# EasyEDA Pro project 正点原子转接.eprj

# Schematic Schematic1
Board Name: Board1; Create Date: 2025-07-12
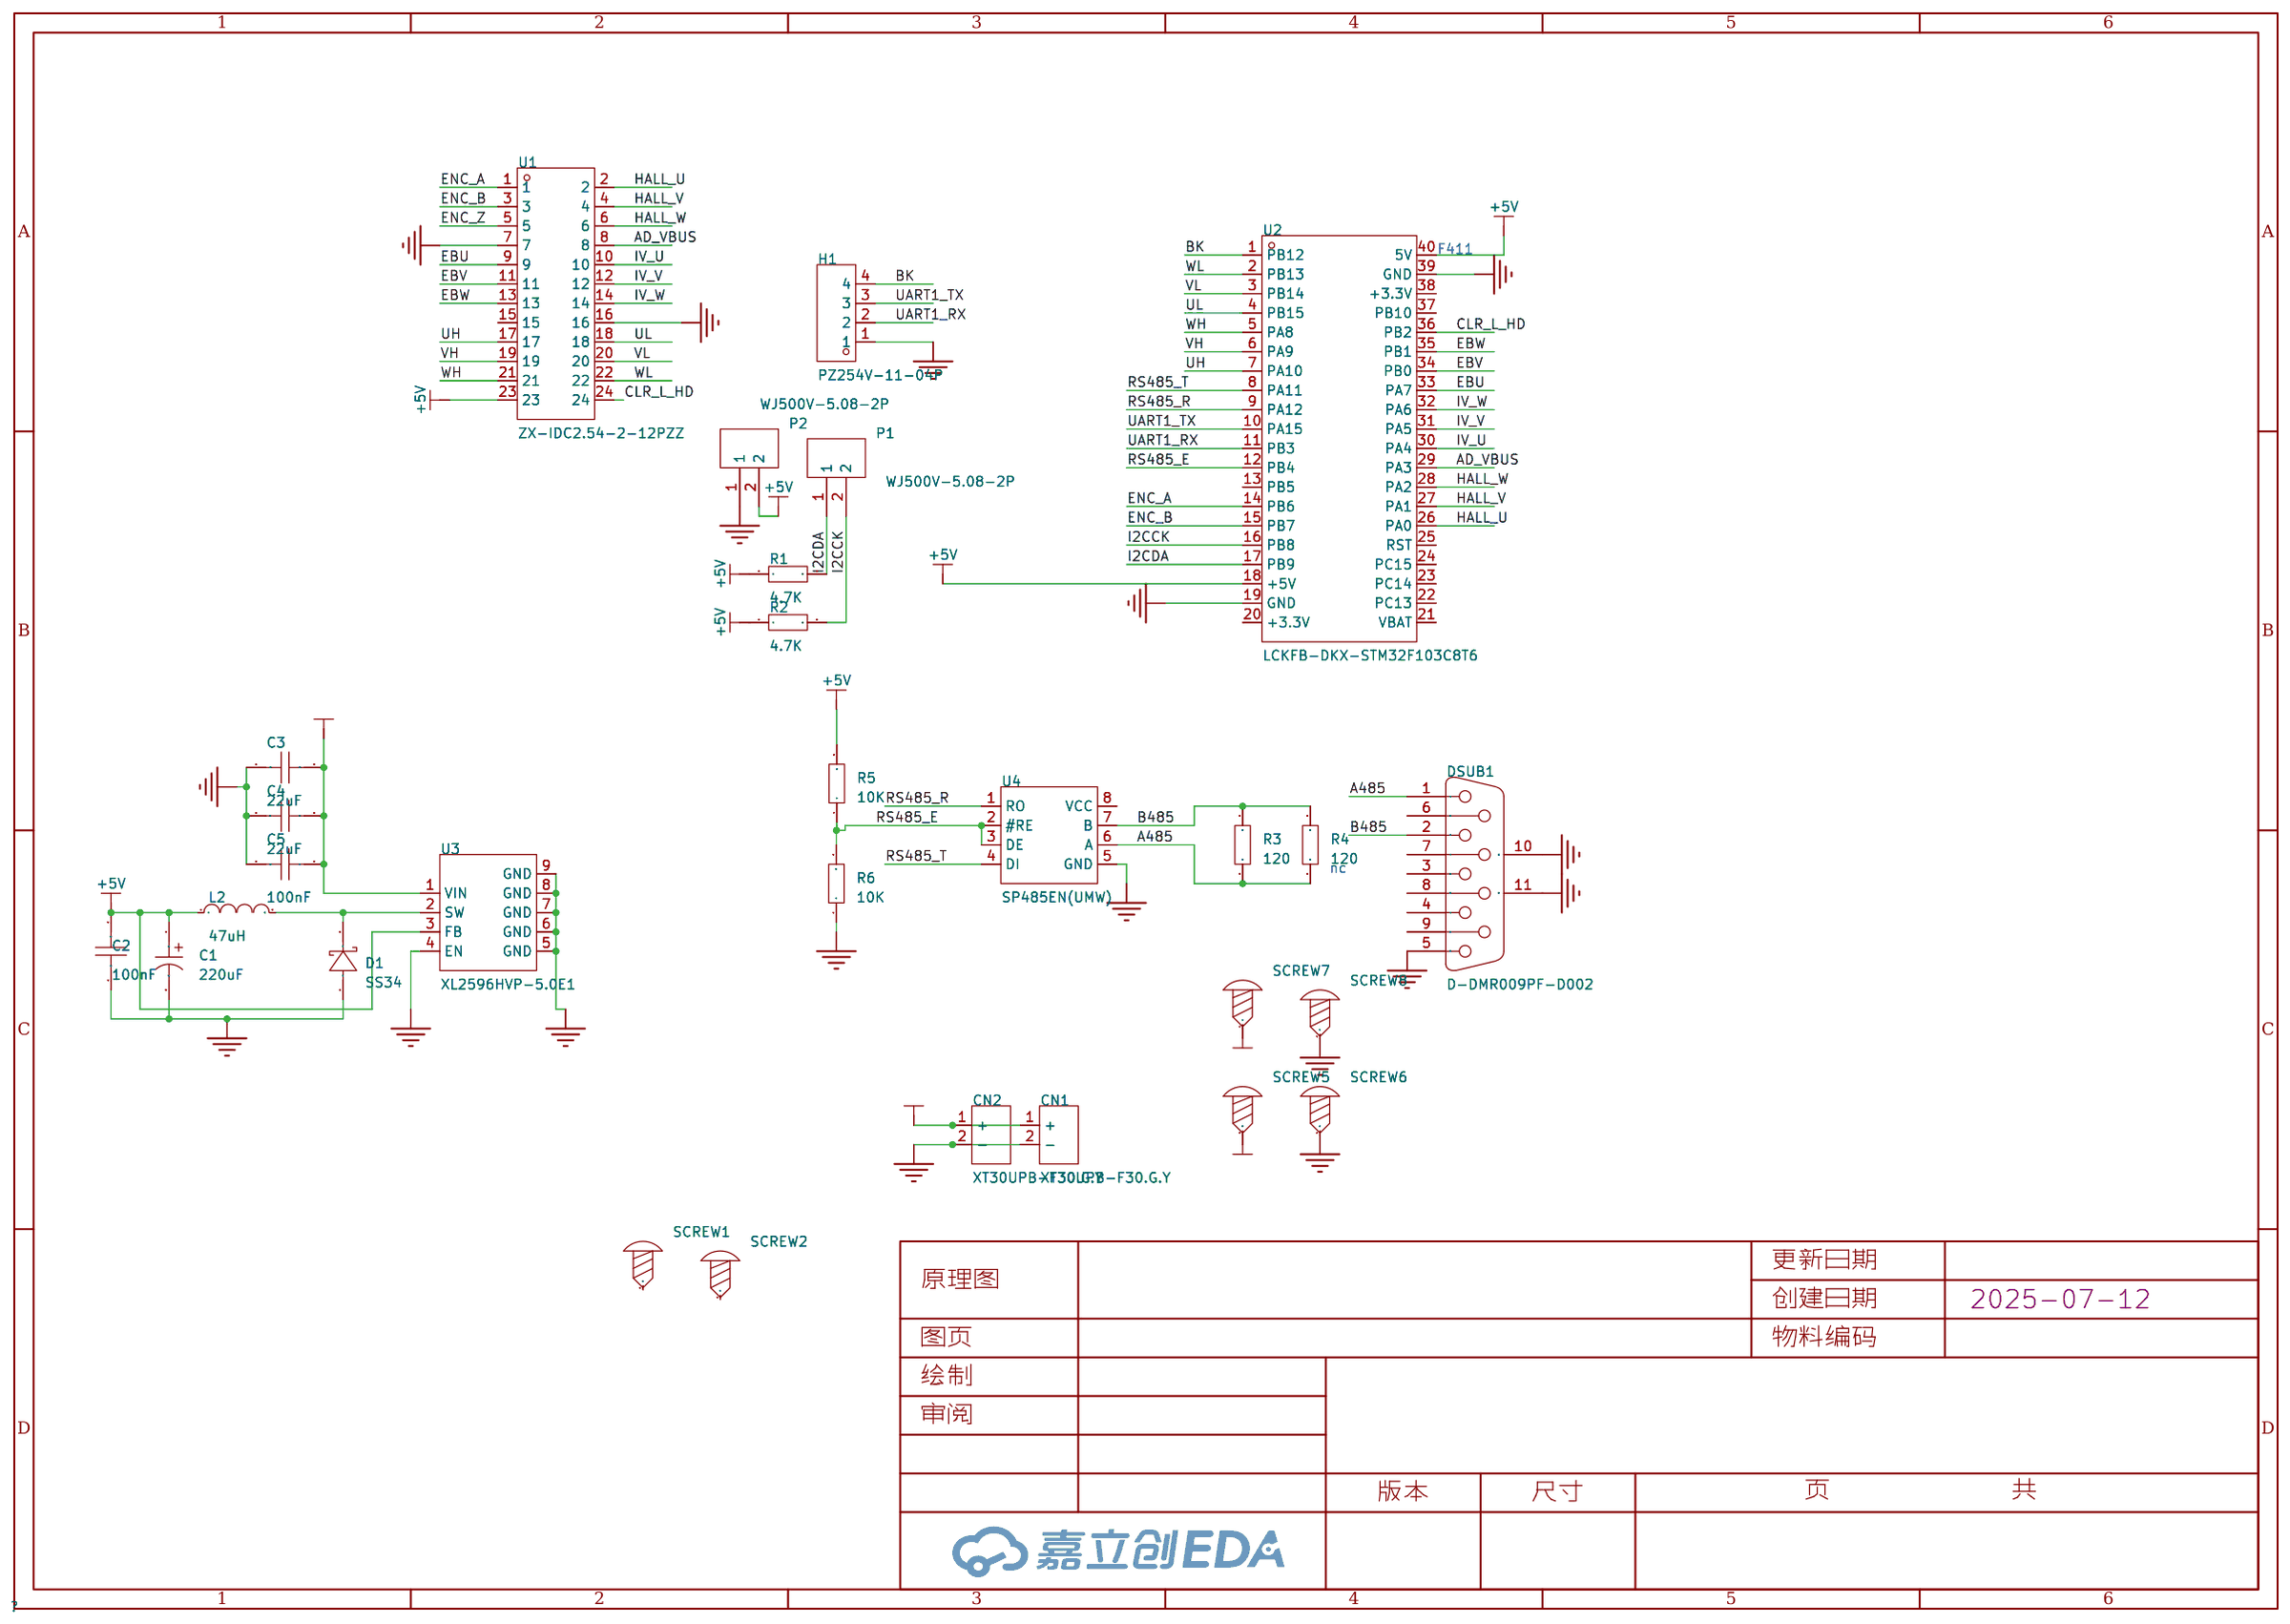
[diagram p0: schematic sheet]

## Parts
C1  220uF  [CAP-SMD_BD10.0-L10.3-W10.3-FD-1]
C2  100nF  [C0603]
C3  22uF  [C1206]
C4  22uF  [C1206]
C5  100nF  [C0603]
CN1  XT30UPB-F30.G.Y  [CONN-TH_XT30UPB-F]
CN2  XT30UPB-F30.G.Y  [CONN-TH_XT30UPB-F]
D1  SS34  [SMA_L4.3-W2.6-LS5.0-FD]
DSUB1  D-DMR009PF-D002  [DSUB-TH_DMR-9S]
H1  PZ254V-11-04P  [HDR-TH_4P-P2.54-V-M]
L2  47uH  [IND-SMD_L7.3-W7.3]
P1  WJ500V-5.08-2P  [CONN-TH_2P-P5.00_WJ500V-5.08-2P]
P2  WJ500V-5.08-2P  [CONN-TH_2P-P5.00_WJ500V-5.08-2P]
R1  4.7K  [R0603]
R2  4.7K  [R0603]
R3  120  [R0603]
R4  120  [R0603]
R5  10K  [R0603]
R6  10K  [R0603]
SCREW1  -  [M3螺丝]
SCREW2  -  [M3螺丝]
SCREW5  -  [M3螺丝]
SCREW6  -  [M3螺丝]
SCREW7  -  [M3螺丝]
SCREW8  -  [M3螺丝]
U1  ZX-IDC2.54-2-12PZZ  [IDC-TH_24P-P2.54_ZX-IDC2.54-2-12PZZ]
U2  LCKFB-DKX-STM32F103C8T6  [CONN-TH_L53.3-W22.9_STM32F103C8T6-CARD]
U3  XL2596HVP-5.0E1  [ESOP-8_L4.9-W3.9-P1.27-LS6.0-BL-EP3.1-1]
U4  SP485EN(UMW)  [SOP-8_L5.0-W4.0-P1.27-LS6.0-BL]

## Library data of the parts
C1 = MA50V220M10x10: LCSC Part Name: 220uF ±20% 50V; Supplier Part: C46550473; Manufacturer: 捷而瑞; Supplier Footprint: SMD,D10xL10mm; JLCPCB Part Class: 扩展库; Datasheet: https://atta.szlcsc.com/upload/public/pdf/source/20250527/0775B60C79545A62B473432786128FCC.pdf; Supplier: LCSC; Tolerance: ±20%; Voltage Rating: 50V; Ripple Current: 3.1A@100kHz; Equivalent Series Resistance(ESR): 30mΩ@100kHz; Type: 聚合物; Diameter: 10mm; Height - Seated (Max): 10mm; Lifetime: 2000hrs@105℃; Operating Temperature: -55℃~+105℃
C2 C5 = CAP_0603: Supplier Footprint: 0603
C3 C4 = CAP_1206: Supplier Footprint: 1206
CN1 CN2 = XT30UPB-F30.G.Y: LCSC Part Name: AMASS(艾迈斯)直立焊板式连接器XT30UPB30-F.G.*; Supplier Part: C108769; Manufacturer: AMASS(艾迈斯); JLCPCB Part Class: 扩展库; Datasheet: https://atta.szlcsc.com/upload/public/pdf/source/20220715/AFD68B9E8B6CA95A7295DBF4AF9325E4.pdf; Supplier: LCSC; Type: 航模插头; Colour: 黄色; RatedVoltage: DC 500V; InterfaceType: 母头; MetalMaterial: 镀金; InsulationMaterial: PA; RatedCurrent: 15A; contact resistance: 0.65mΩ
D1 = SS34_C7420365: LCSC Part Name: 电压:40V 电流:3A; Supplier Part: C7420365; Manufacturer: 宏迦橙; Supplier Footprint: SMA(DO-214AC); JLCPCB Part Class: 扩展库; Datasheet: https://atta.szlcsc.com/upload/public/pdf/source/20230828/75438452AEE6C276EDA92B2AF599BE05.pdf; Supplier: LCSC; Diode Configuration: 独立式; Forward Voltage (Vf@If): 550mV@3.0A; Reverse Voltage (Vr): 40V; Average Rectified Current (Io): 3A; Reverse Leakage Current (Ir): 200uA@40V; Peak forward surge current: 80A
DSUB1 = D-DMR009PF-D002: LCSC Part Name: D-Sub 母 P数:9P; Supplier Part: C141882; Manufacturer: Ckmtw(灿科盟); Supplier Footprint: 弯插; JLCPCB Part Class: 扩展库; Datasheet: https://atta.szlcsc.com/upload/public/pdf/source/20171123/C141882_15114109686951137625.pdf; Supplier: LCSC; Connector Type: 常规D-Sub; Gender: 母; Number of Pins: 9P; Mounting Style: 弯插; Number of Rows: 2; Current Rating-Signal (Max): 3A; Colour: 黑色; Operating Temperature Range: -50℃~+105℃
H1 = PZ254V-11-04P: LCSC Part Name: 间距:2.54mm 1x4P 直插 方针; Supplier Part: C2691448; Manufacturer: XFCN(兴飞); Supplier Footprint: 插件,P=2.54mm; JLCPCB Part Class: 扩展库; Datasheet: https://atta.szlcsc.com/upload/public/pdf/source/20200309/C492403_F9F19131791D08044AD4F84F8E751A34.pdf; Supplier: LCSC; Pin Structure: 1x4P; Pitch: 2.54mm; Circluar Pins/Square Pins: 方针; Mounting Type: 直插; Number of Rows: 单排; Number of Pins: 4P; Current Rating (Max): 3A; Voltage Rating (Max): 250V; Length of Mating Pin: 6mm; Insulation Height: 2.5mm; Length of End Connection Pin: 3mm; Operating Temperature Range: -40℃~+105℃; Color: 黑色
L2 = MS74-101MT: 电感值:100uH;精度:±20%;额定电流:600mA;; LCSC Part Name: 100uH ±20%; Supplier Part: C158091; Manufacturer: FH(风华); Supplier Footprint: SMD; JLCPCB Part Class: 扩展库; Datasheet: https://atta.szlcsc.com/upload/public/pdf/source/20230324/9C82CFEF61378E0F42D00C438BC444D6.pdf; Supplier: LCSC; Tolerance: ±20%; Rated Current: 600mA; DC Resistance (DCR): 610mΩ
P1 P2 = WJ500V-5.08-2P: LCSC Part Name: 1x2P 5.08mm 直插 排数:1 每排P数:2; Supplier Part: C8465; Manufacturer: KANGNEX(康奈克斯电气); Supplier Footprint: 插件,P=5.08mm; JLCPCB Part Class: 扩展库; Datasheet: https://atta.szlcsc.com/upload/public/pdf/source/20191225/C8465_02D34CE5B5B4A53DF5891601D97FA9F4.pdf; Supplier: LCSC; Structure: 1x2P; Pitch: 5.08mm; Color: 绿色; Mounting Style: 直插; Current Rating (Max): 18A; Voltage Rating (Max): 250V; Number of Pins: 2P; Number of Rows: 1; Wire Gauge - AWG: 14~30; Wire Gauge - mm2: 2.5; Number of PINs Per Row: 2; Operating Temperature Range: -40℃~+105℃; Screw Specification: M2.5
R1-R6 = Res_0603: Supplier Footprint: 0603
SCREW1 SCREW2 SCREW5-SCREW8 = M3螺丝: Supplier Footprint: 插件
U1 = ZX-IDC2.54-2-12PZZ: LCSC Part Name: 2.54mm 2x12P 排数:2 每排P数:12; Supplier Part: C7501246; Manufacturer: Megastar(兆星); Supplier Footprint: 插件,P=2.54mm; JLCPCB Part Class: 扩展库; Datasheet: https://atta.szlcsc.com/upload/public/pdf/source/20231122/BEFACB3BB5AFDE9F4D71476C71D0F801.pdf; Supplier: LCSC; Connector Type: 简牛座; Pitch: 2.54mm; Structure: 2x12P; Current Rating (Max): 3A; Voltage Rating (Max): 1kV; Holder Type: 直插; Row Spacing: 2.54mm; Number of Rows: 2; Pin Number in each Row: 12; Contact Material: 黄铜; Contact Plating: 金; Operating Temperature Range: -40℃~+105℃; Soldering Temperature(Max): 260℃@10S
U2 = LCKFB-DKX-STM32F103C8T6: LCSC Part Name: 立创·地阔星-STM32F103C8T6开发板; Supplier Part: C22396880; Manufacturer: 立创开发板; JLCPCB Part Class: 扩展库; Datasheet: https://atta.szlcsc.com/upload/public/pdf/source/20241206/D7467B743BEDB0C7B9E08FA0EBB7E773.pdf; Supplier: LCSC
U3 = XL2596HVP-5.0E1: Supplier Part: C7461043; Manufacturer: XLSEMI(芯龙); Supplier Footprint: SOP-8-EP; JLCPCB Part Class: 扩展库; Datasheet: https://atta.szlcsc.com/upload/public/pdf/source/20241127/F43DA394EA2C59857BFE09DC8EEB97B2.pdf; Supplier: LCSC
U4 = SP485EN(UMW): LCSC Part Name: SP485EN; Supplier Part: C668207; Manufacturer: UMW(友台半导体); Supplier Footprint: SOP-8; JLCPCB Part Class: 扩展库; Datasheet: https://atta.szlcsc.com/upload/public/pdf/source/20240223/2B56DCCF84742DD6FB038C4235152EF3.pdf; Supplier: LCSC; Type: 收发器; Number of Drivers: 1; Number of Receivers: 1; Voltage - Supply: 4.75V~5.25V; Data Rate: 2.5Mbps

## Nets
+5V: C1.1 C2.2 L2.1 P2.2 R1.1 R2.1 R5.2 U1.23 U2.18(+5V) U2.40(5V) U3.3(FB)
GND: C1.2 C2.1 C3.1 C4.1 C5.2 CN1.2(-) CN2.2(-) D1.1(A) DSUB1.5 DSUB1.10(MH1) DSUB1.11(MH2) H1.1 P2.1 R6.1 SCREW6.1 SCREW8.1 U1.7 U1.16 U2.19(GND) U2.39(GND) U3.4(EN) U3.5(GND) U3.6(GND) U3.7(GND) U3.8(GND) U3.9(GND) U4.5(GND)
VBUS: C3.2 C4.2 C5.1 CN1.1(+) CN2.1(+) SCREW5.1 SCREW7.1 U3.1(VIN)
A485: DSUB1.1 R3.1 R4.1 U4.6(A)
AD_VBUS: U1.8 U2.29(PA3)
B485: DSUB1.2 R3.2 R4.2 U4.7(B)
BK: H1.4 U2.1(PB12)
CLR_L_HD: U1.24 U2.36(PB2)
EBU: U1.9 U2.33(PA7)
EBV: U1.11 U2.34(PB0)
EBW: U1.13 U2.35(PB1)
ENC_A: U1.1 U2.14(PB6)
ENC_B: U1.3 U2.15(PB7)
ENC_Z: U1.5
HALL_U: U1.2 U2.26(PA0)
HALL_V: U1.4 U2.27(PA1)
HALL_W: U1.6 U2.28(PA2)
I2CCK: P1.2 R2.2 U2.16(PB8)
I2CDA: P1.1 R1.2 U2.17(PB9)
IV_U: U1.10 U2.30(PA4)
IV_V: U1.12 U2.31(PA5)
IV_W: U1.14 U2.32(PA6)
RS485_E: R5.1 R6.2 U2.12(PB4) U4.2(#RE) U4.3(DE)
RS485_R: U2.9(PA12) U4.1(RO)
RS485_T: U2.8(PA11) U4.4(DI)
UART1_RX: H1.2 U2.11(PB3)
UART1_TX: H1.3 U2.10(PA15)
UH: U1.17 U2.7(PA10)
UL: U1.18 U2.4(PB15)
VH: U1.19 U2.6(PA9)
VL: U1.20 U2.3(PB14)
WH: U1.21 U2.5(PA8)
WL: U1.22 U2.2(PB13)
$1N1168: D1.2(K) L2.2 U3.2(SW)

Not connected (* = marked no-connect by the designer): DSUB1 3 4 6 7 8 9; SCREW1 1; SCREW2 1; U1 15; U2 13(PB5) 20(+3.3V) 21(VBAT) 22(PC13) 23(PC14) 24(PC15) 25(RST) 37(PB10) 38(+3.3V); U4 8(VCC)

## Notes on the sheet
- F411
- nc

# Board PCB1
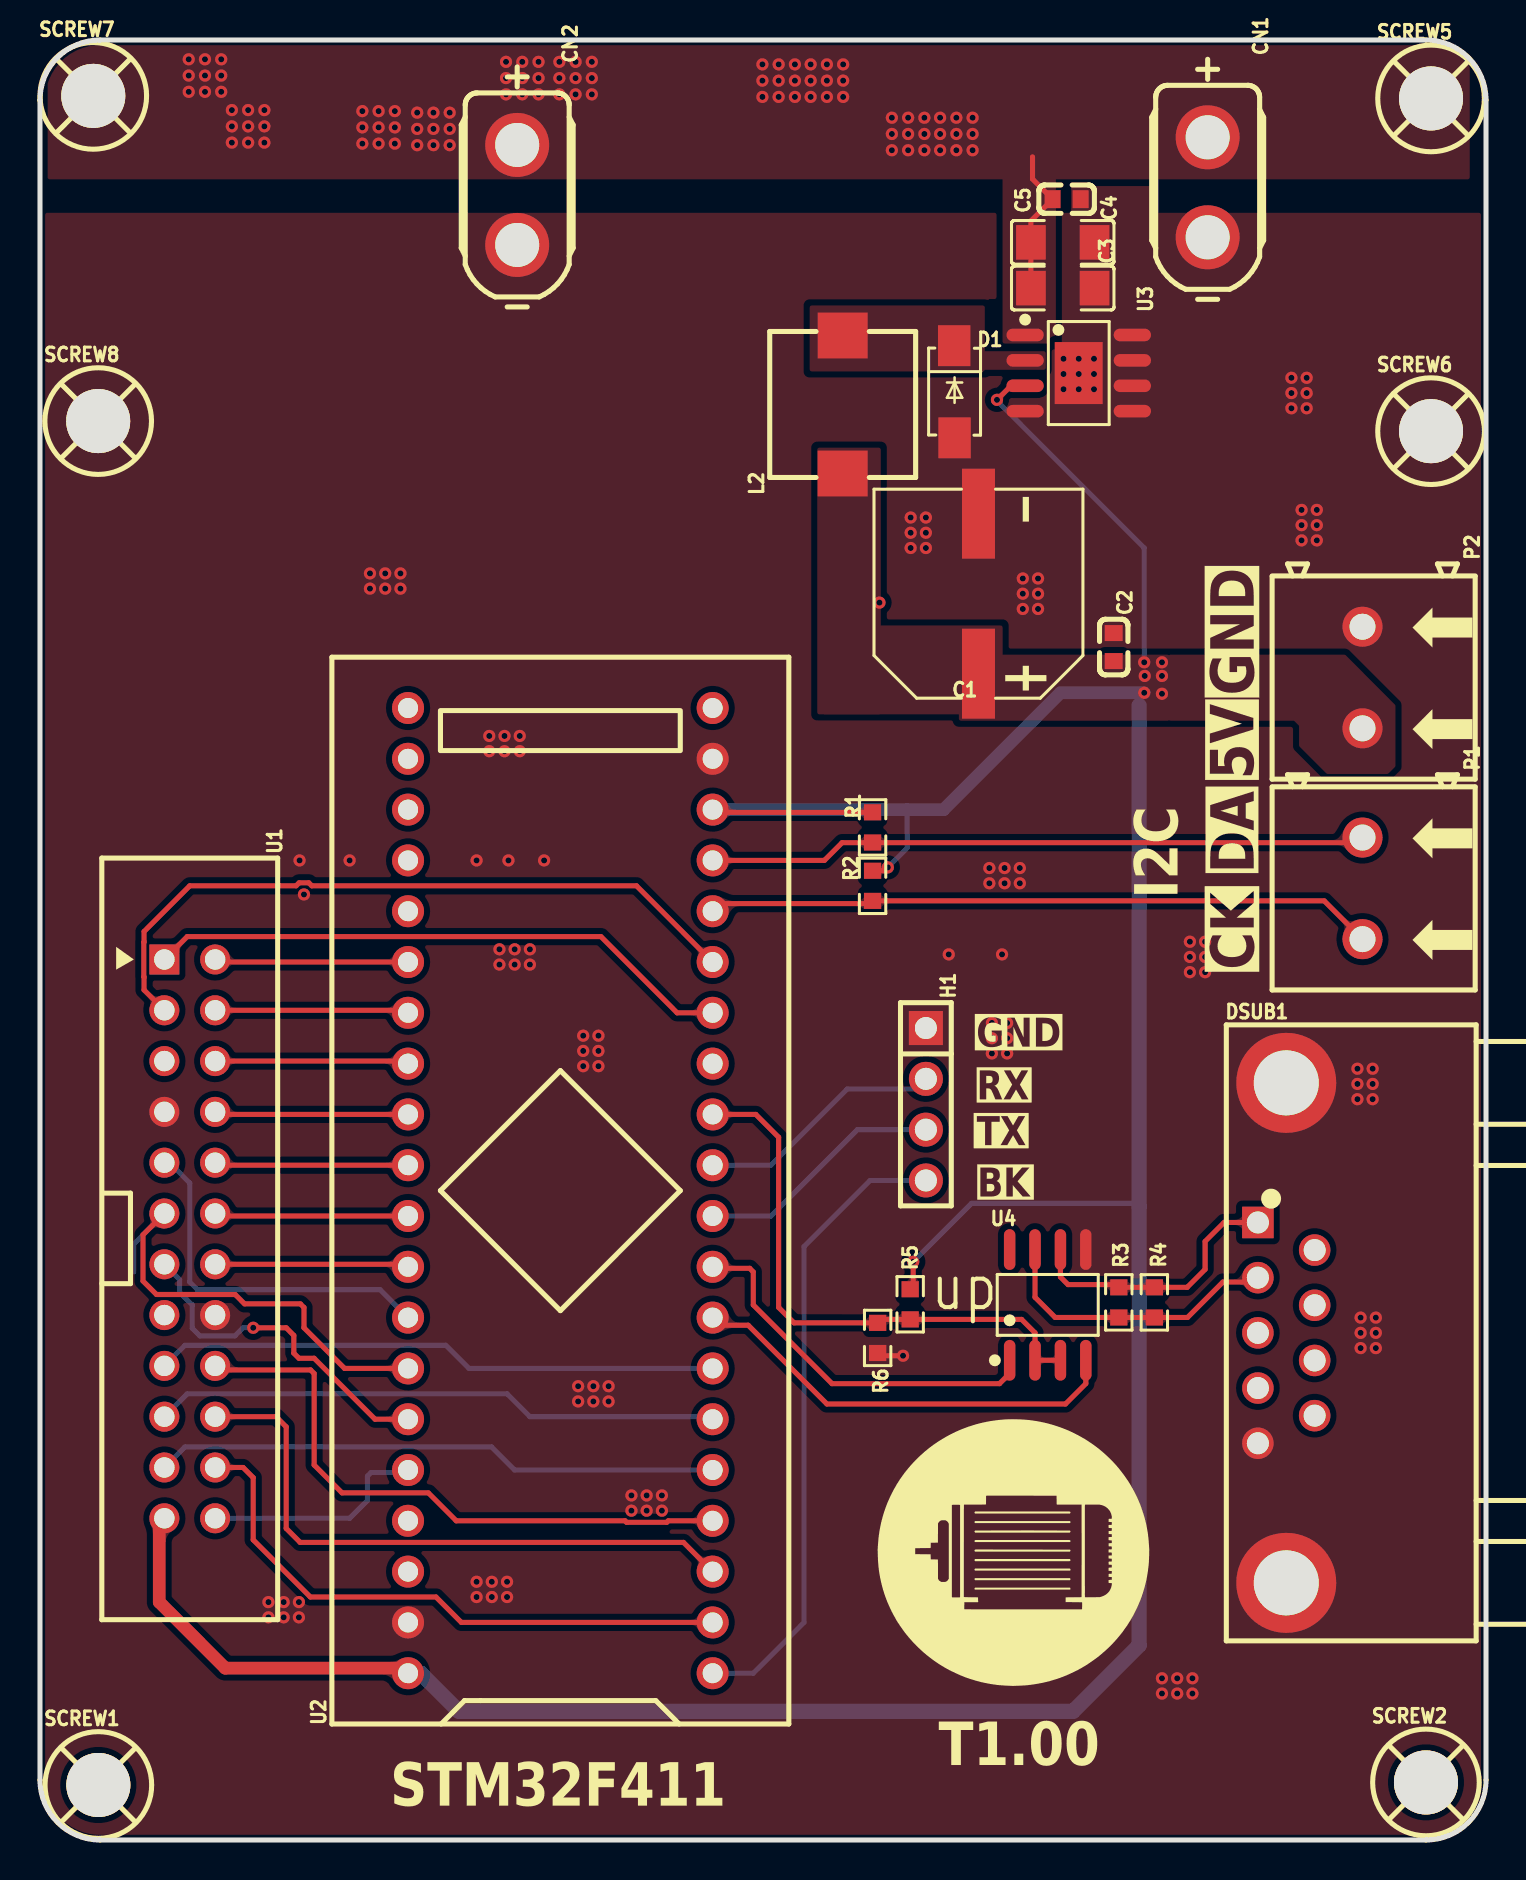
[diagram p1: board, top side]
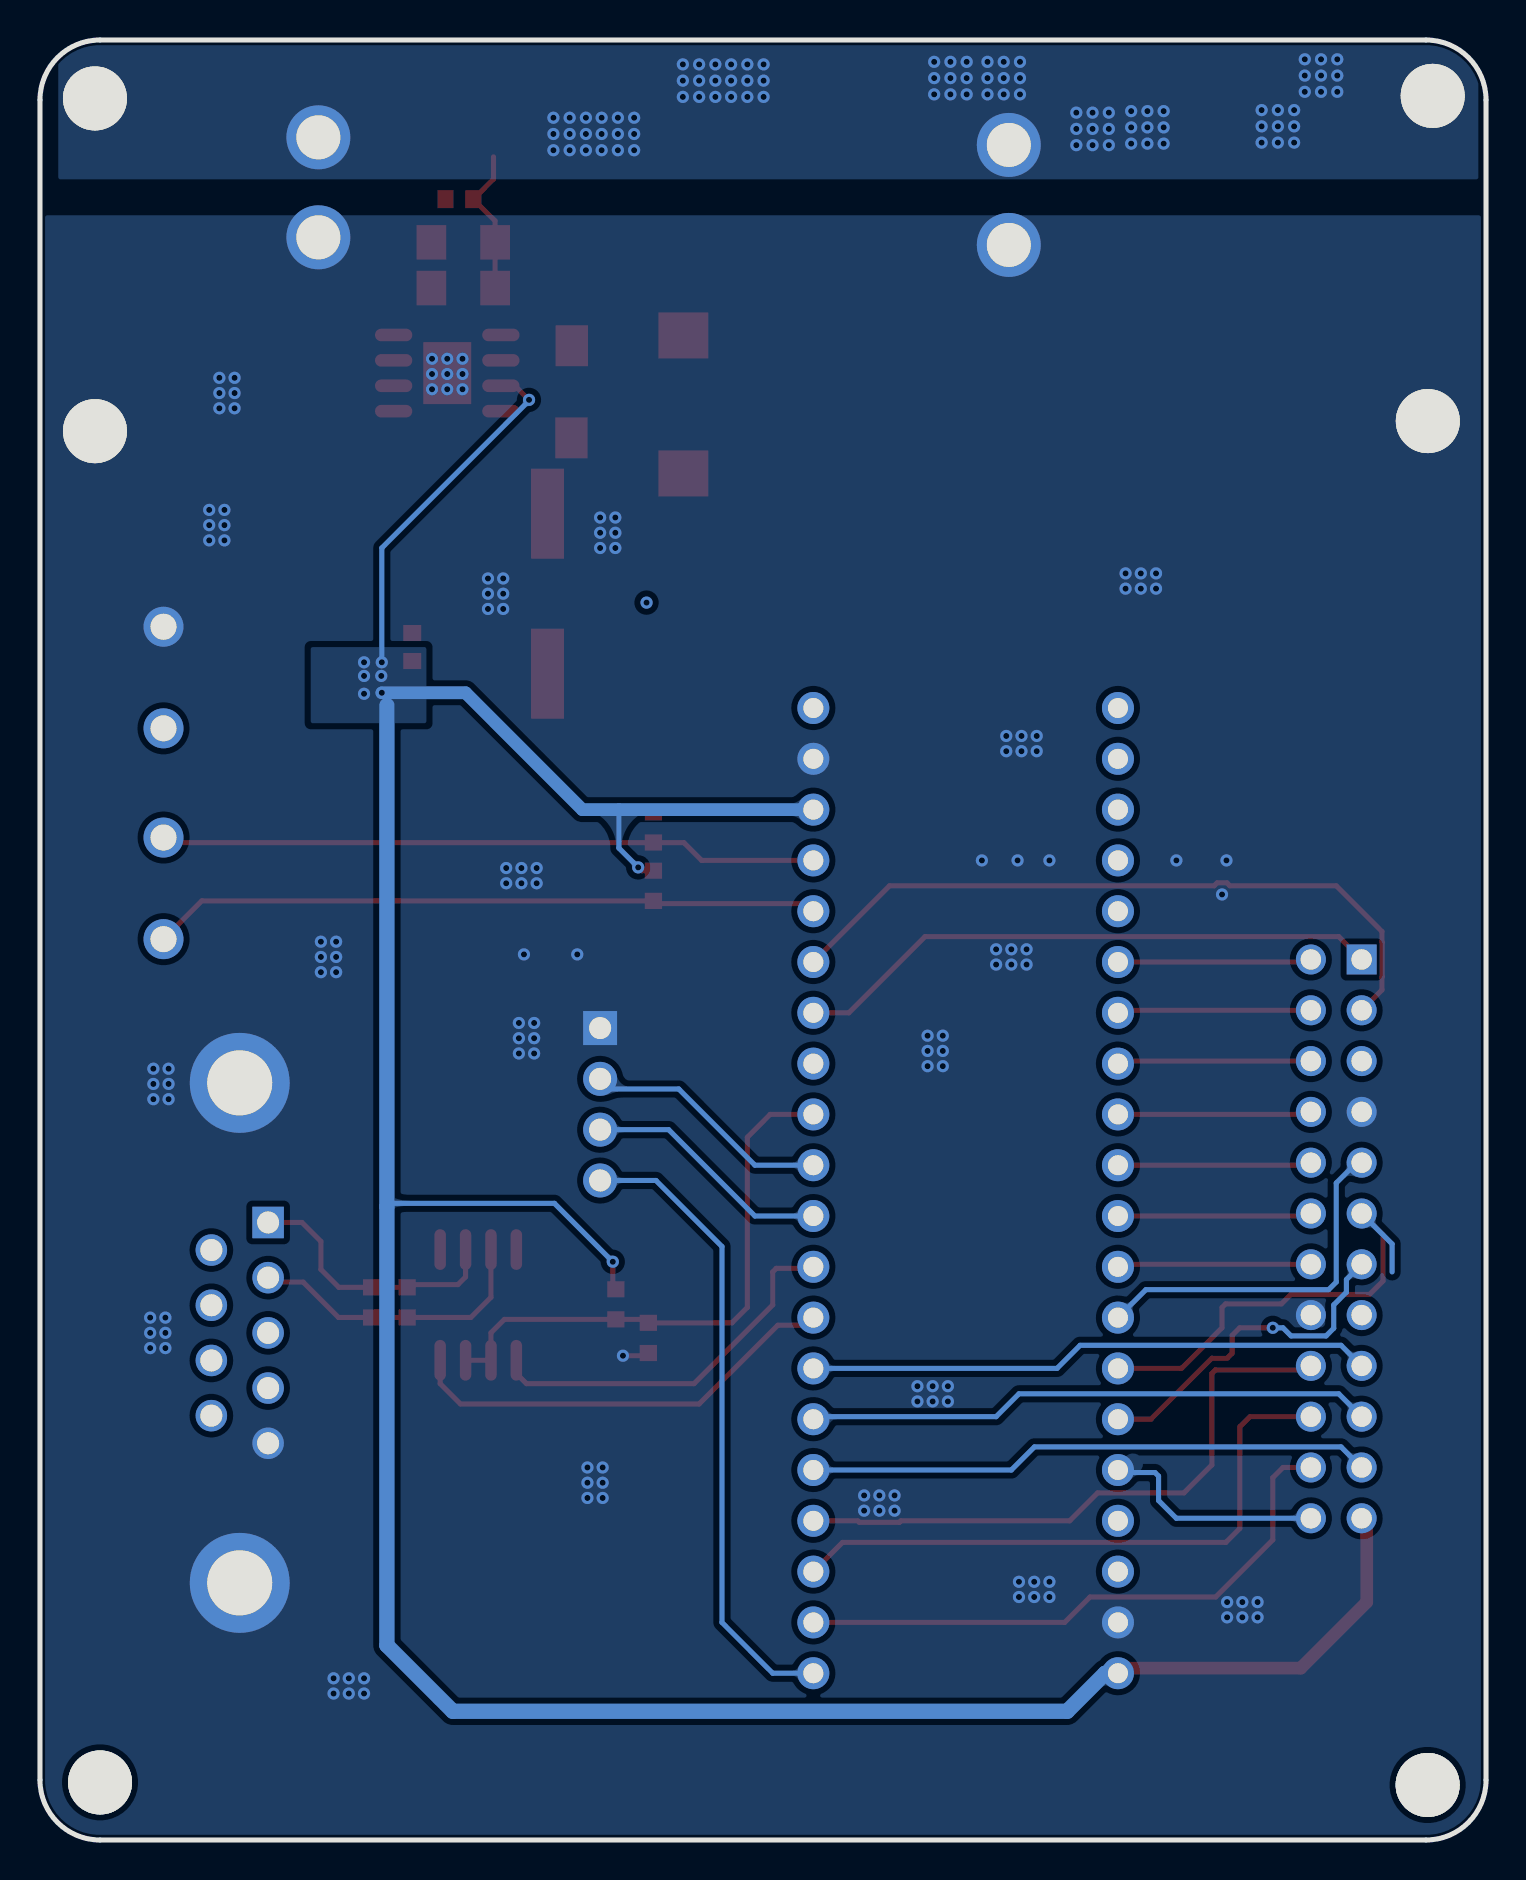
[diagram p2: board, bottom side, seen from below]

Outline 72.35 x 90 mm; copper layers: Top Layer, Bottom Layer. Coordinates in mm from the lower left corner of the outline.
Outline path: 0,87 0,3 arc(0.88,0.88) 3,0 69.35,0 arc(71.47,0.88) 72.35,3 72.35,87 arc(71.47,89.12) 69.35,90 3,90 arc(0.88,89.12) 0,87
Stack: Top Layer 0.035mm / Dielectric1 1.51mm FR4 er 4.5 / Bottom Layer 0.035mm

## Design rules (mm)
template: 自定义配置
spacing copperThickness1oz (default): track to track 0.102, other pairs 0.152 to 0.3
spacing copperThickness2oz: track to track 0.203, other pairs 0.152 to 0.3
track width copperThickness1oz (default): min 0.127, default 0.254, max 2.54
track width copperThickness2oz: min 0.203, default 0.254, max 2.54
differential pair differentialPair (default): width min 0.127, default 0.254, max 2.54; gap min 0.152, default 0.152
via viaSize (default): diameter min 0.5, default 0.61, max 10; hole min 0.3, default 0.305, max 6.3

## Placement (name value [footprint] x y rotation side)
C1  220uF  [CAP-SMD_BD10.0-L10.3-W10.3-FD-1]  46.95 62.31 90 top
C2  100nF  [C0603]  53.72 59.65 270 top
C3  22uF  [C1206]  51.17 77.6 180 top
C4  22uF  [C1206]  51.17 79.88 180 top
C5  100nF  [C0603]  51.36 82.04 0 top
CN1  XT30UPB-F30.G.Y  [CONN-TH_XT30UPB-F]  58.42 82.63 270 top
CN2  XT30UPB-F30.G.Y  [CONN-TH_XT30UPB-F]  23.88 82.25 270 top
D1  SS34  [SMA_L4.3-W2.6-LS5.0-FD]  45.75 72.41 90 top
DSUB1  D-DMR009PF-D002  [DSUB-TH_DMR-9S]  62.35 25.36 0 top
H1  PZ254V-11-04P  [HDR-TH_4P-P2.54-V-M]  44.32 36.79 270 top
L2  47uH  [IND-SMD_L7.3-W7.3]  40.16 71.78 90 top
P1  WJ500V-5.08-2P  [CONN-TH_2P-P5.00_WJ500V-5.08-2P]  66.17 47.58 270 top
P2  WJ500V-5.08-2P  [CONN-TH_2P-P5.00_WJ500V-5.08-2P]  66.17 58.12 270 top
R1  4.7K  [R0603]  41.66 50.63 270 top
R2  4.7K  [R0603]  41.66 47.71 270 top
R3  120  [R0603]  53.97 26.88 270 top
R4  120  [R0603]  55.75 26.88 270 top
R5  10K  [R0603]  43.54 26.78 90 top
R6  10K  [R0603]  41.91 25.1 90 top
SCREW1  -  [M3螺丝]  2.92 2.75 0 top
SCREW2  -  [M3螺丝]  69.34 2.88 0 top
SCREW5  -  [M3螺丝]  69.6 87.08 0 top
SCREW6  -  [M3螺丝]  69.6 70.44 0 top
SCREW7  -  [M3螺丝]  2.67 87.21 0 top
SCREW8  -  [M3螺丝]  2.91 70.95 0 top
U1  ZX-IDC2.54-2-12PZZ  [IDC-TH_24P-P2.54_ZX-IDC2.54-2-12PZZ]  7.49 30.06 270 top
U2  LCKFB-DKX-STM32F103C8T6  [CONN-TH_L53.3-W22.9_STM32F103C8T6-CARD]  26.03 32.47 90 top
U3  XL2596HVP-5.0E1  [ESOP-8_L4.9-W3.9-P1.27-LS6.0-BL-EP3.1-1]  51.97 73.35 270 top
U4  SP485EN(UMW)  [SOP-8_L5.0-W4.0-P1.27-LS6.0-BL]  50.42 26.75 0 top

## Footprints (pads in the part's own frame, mm; a bottom-side part is the same pattern mirrored in y, then rotated)
C0603
  rect 0.8x0.9 smd: 1(-0.7,0) 2(0.7,0)
C1206
  rect 1.485x1.728 smd: 1(-1.593,0) 2(1.593,0)
CAP-SMD_BD10.0-L10.3-W10.3-FD-1
  rect 4.5x1.65 smd: 1(-4,0) 2(4,0)
CONN-TH_2P-P5.00_WJ500V-5.08-2P
  round 2 hole 1.3: 1(-2.54,0) 2(2.54,0)
CONN-TH_L53.3-W22.9_STM32F103C8T6-CARD
  round 1.6 hole 1: 1(-24.13,-7.62) 2(-21.59,-7.62) 3(-19.05,-7.62) 4(-16.51,-7.62) 5(-13.97,-7.62) 6(-11.43,-7.62) 7(-8.89,-7.62) 8(-6.35,-7.62) 9(-3.81,-7.62) 10(-1.27,-7.62) 11(1.27,-7.62) 12(3.81,-7.62) 13(6.35,-7.62) 14(8.89,-7.62) 15(11.43,-7.62) 16(13.97,-7.62) 17(16.51,-7.62) 18(19.05,-7.62) 19(21.59,-7.62) 20(24.13,-7.62) 21(24.13,7.62) 22(21.59,7.62) 23(19.05,7.62) 24(16.51,7.62) 25(13.97,7.62) 26(11.43,7.62) 27(8.89,7.62) 28(6.35,7.62) 29(3.81,7.62) 30(1.27,7.62) 31(-1.27,7.62) 32(-3.81,7.62) 33(-6.35,7.62) 34(-8.89,7.62) 35(-11.43,7.62) 36(-13.97,7.62) 37(-16.51,7.62) 38(-19.05,7.62) 39(-21.59,7.62) 40(-24.13,7.62)
CONN-TH_XT30UPB-F
  round 3.2 hole 2.2: 1(-2.5,0) 2(2.5,0)
DSUB-TH_DMR-9S
  rect 1.575x1.575 hole 1.1: 1(-1.42,5.52)
  round 1.575 hole 1.1: 2(-1.42,2.76) 3(-1.42,0) 4(-1.42,-2.76) 5(-1.42,-5.52) 6(1.42,4.14) 7(1.42,1.38) 8(1.42,-1.38) 9(1.42,-4.14)
  round 5 hole 3.25: 10(0,12.5) 11(0,-12.5)
ESOP-8_L4.9-W3.9-P1.27-LS6.0-BL-EP3.1-1
  oval 0.63x1.865 smd: 1(-1.905,-2.683) 2(-0.635,-2.683) 3(0.635,-2.683) 4(1.905,-2.683) 5(1.905,2.683) 6(0.635,2.683) 7(-0.635,2.683) 8(-1.905,2.683)
  rect 3.1x2.4 smd: 9(0,0)
HDR-TH_4P-P2.54-V-M
  rect 1.7x1.7 hole 1.1: 1(-3.81,0)
  round 1.7 hole 1.1: 2(-1.27,0) 3(1.27,0) 4(3.81,0)
IDC-TH_24P-P2.54_ZX-IDC2.54-2-12PZZ
  rect 1.5x1.5 hole 1.02: 1(-13.97,-1.27)
  round 1.5 hole 1.02: 2(-13.97,1.27) 3(-11.43,-1.27) 4(-11.43,1.27) 5(-8.89,-1.27) 6(-8.89,1.27) 7(-6.35,-1.27) 8(-6.35,1.27) 9(-3.81,-1.27) 10(-3.81,1.27) 11(-1.27,-1.27) 12(-1.27,1.27) 13(1.27,-1.27) 14(1.27,1.27) 15(3.81,-1.27) 16(3.81,1.27) 17(6.35,-1.27) 18(6.35,1.27) 19(8.89,-1.27) 20(8.89,1.27) 21(11.43,-1.27) 22(11.43,1.27) 23(13.97,-1.27) 24(13.97,1.27)
IND-SMD_L7.3-W7.3
  rect 2.3x2.5 smd: 1(-3.45,0) 2(3.45,0)
M3螺丝
  round 3.2 hole 3.2: 1(0,0)
R0603
  rect 0.806x0.864 smd: 1(-0.753,0) 2(0.753,0)
SMA_L4.3-W2.6-LS5.0-FD
  rect 2.046x1.62 smd: 1(-2.304,-0.009) 2(2.304,0.009)
SOP-8_L5.0-W4.0-P1.27-LS6.0-BL
  oval 0.574x2.035 smd: 1(-1.905,-2.768) 2(-0.635,-2.768) 3(0.635,-2.768) 4(1.905,-2.768) 5(1.905,2.768) 6(0.635,2.768) 7(-0.635,2.768) 8(-1.905,2.768)

## Nets
As in the schematic.

Pads without a net: DSUB1 3 4 6 7 8 9; SCREW1 1; SCREW2 1; U1 15; U2 13 20 21 22 23 24 25 37 38; U4 8

## Via types
v1: diameter 0.61, hole 0.305, Top Layer to Bottom Layer, 233 vias

## Routing (per net, layer and track width the routed paths; a pad name or vN(x,y) marks a point on that pad's centre or on a via; arc(x,y) is an arc through that point)
+5V: length 172.5
  Top Layer w0.254: U3.3 48.58,72.71 v1(47.88,72.01) ; 33.78,51.52 33.92,51.38 R1.1 ; 47.4,57.87 46.95,58.31 ; v1(42.42,48.63) 42.25,48.46 R2.1 ; 43.54,27.54 43.69,27.69 v1(43.69,28.91)
  Top Layer w0.635: U2.40 18.16,8.59 9.27,8.59 5.97,11.9 5.97,15.83 U1.23
  Bottom Layer w0.254: v1(43.69,28.91) 46.61,31.83 54.83,31.83 54.99,31.68 ; 43.38,51.52 43.38,49.6 v1(42.42,48.63) ; v1(55.25,58.89) 55.25,64.6 47.88,71.97 v1(47.88,72.01)
  Bottom Layer w0.635: v1(55.25,57.36) 51.05,57.36 45.21,51.52 33.66,51.52
  Bottom Layer w0.762: U2.40 19.05,8.34 20.96,6.43 51.69,6.43 54.99,9.74 54.99,56.73
  vias: v1(42,61.87) v1(55.27,58.2) v1(56.13,58.89) v1(56.13,58.2) v1(56.13,57.31)
GND: length 1.3
  Top Layer w0.254: v1(43.18,24.21) 42.05,24.21 R6.1
  vias: v1(11.43,11.9) v1(11.43,11.13) v1(12.19,11.9) v1(12.19,11.13) v1(12.99,48.98) v1(12.95,11.9) v1(12.95,11.13) v1(13.21,47.28) v1(15.49,48.98) v1(16.51,63.33) v1(16.51,62.57) v1(17.27,63.33) v1(17.27,62.57) v1(18.03,63.33) v1(18.03,62.57) v1(21.84,48.98) v1(21.84,12.91) v1(21.84,12.15) v1(22.48,55.2) v1(22.48,54.44) v1(22.61,12.91) v1(22.61,12.15) v1(22.99,44.53) v1(22.99,43.77) v1(23.24,55.2) v1(23.24,54.44) v1(23.44,48.98) v1(23.37,12.91) v1(23.37,12.15) v1(23.75,44.53) v1(23.75,43.77) v1(24,55.2) v1(24,54.44) v1(24.51,44.53) v1(24.51,43.77) v1(25.22,48.98) v1(26.92,22.69) v1(26.92,21.93) v1(27.18,40.22) v1(27.18,39.45) v1(27.18,38.69) v1(27.69,22.69) v1(27.69,21.93) v1(27.94,40.22) v1(27.94,39.45) v1(27.94,38.69) v1(28.45,22.69) v1(28.45,21.93) v1(29.59,17.23) v1(29.59,16.47) v1(30.35,17.23) v1(30.35,16.47) v1(31.12,17.23) v1(31.12,16.47) v1(43.56,66.12) v1(43.56,65.36) v1(43.56,64.6) v1(44.2,18.63) v1(44.2,17.86) v1(44.2,17.1) v1(44.32,66.12) v1(44.32,65.36) v1(44.32,64.6) v1(44.96,18.63) v1(44.96,17.86) v1(44.96,17.1) v1(45.47,44.28) v1(47.5,48.6) v1(47.5,47.84) v1(47.62,40.85) v1(47.62,40.09) v1(47.62,39.33) v1(48.13,44.28) v1(48.26,48.6) v1(48.26,47.84) v1(48.39,40.85) v1(48.39,40.09) v1(48.39,39.33) v1(49.02,48.6) v1(49.02,47.84) v1(49.17,63.08) v1(49.17,62.31) v1(49.17,61.55) v1(49.93,63.08) v1(49.93,62.31) v1(49.93,61.55) v1(51.21,74.06) v1(51.21,73.3) v1(51.21,72.54) v1(51.97,74.06) v1(51.97,73.3) v1(51.97,72.54) v1(52.73,74.06) v1(52.73,73.3) v1(52.73,72.54) v1(56.13,8.09) v1(56.13,7.32) v1(56.9,8.09) v1(56.9,7.32) v1(57.53,44.92) v1(57.53,44.15) v1(57.53,43.39) v1(57.66,8.09) v1(57.66,7.32) v1(58.29,44.92) v1(58.29,44.15) v1(58.29,43.39) v1(62.61,73.11) v1(62.61,72.35) v1(62.61,71.58) v1(63.12,66.5) v1(63.12,65.74) v1(63.12,64.98) v1(63.37,73.11) v1(63.37,72.35) v1(63.37,71.58) v1(63.88,66.5) v1(63.88,65.74) v1(63.88,64.98) v1(65.91,38.56) v1(65.91,37.8) v1(65.91,37.04) v1(66.07,26.12) v1(66.07,25.36) v1(66.07,24.59) v1(66.68,38.56) v1(66.68,37.8) v1(66.68,37.04) v1(66.83,26.12) v1(66.83,25.36) v1(66.83,24.59)
VBUS: length 7.4
  Top Layer w0.254: C3.2 C4.2 49.58,80.95 C5.1 49.66,83.05 49.66,84.16
  vias: v1(7.44,89.03) v1(7.44,88.22) v1(7.44,87.41) v1(8.25,89.03) v1(8.25,88.22) v1(8.25,87.41) v1(9.07,89.03) v1(9.07,88.22) v1(9.07,87.41) v1(9.6,86.5) v1(9.6,85.68) v1(9.6,84.87) v1(10.41,86.5) v1(10.41,85.68) v1(10.41,84.87) v1(11.23,86.5) v1(11.23,85.68) v1(11.23,84.87) v1(16.13,86.44) v1(16.13,85.63) v1(16.13,84.82) v1(16.94,86.44) v1(16.94,85.63) v1(16.94,84.82) v1(17.75,86.44) v1(17.75,85.63) v1(17.75,84.82) v1(18.87,86.37) v1(18.87,85.56) v1(18.87,84.74) v1(19.69,86.37) v1(19.69,85.56) v1(19.69,84.74) v1(20.5,86.37) v1(20.5,85.56) v1(20.5,84.74) v1(23.32,88.91) v1(23.32,88.09) v1(23.32,87.28) v1(24.13,88.91) v1(24.13,88.09) v1(24.13,87.28) v1(24.94,88.91) v1(24.94,88.09) v1(24.94,87.28) v1(25.98,88.91) v1(25.98,88.09) v1(25.98,87.28) v1(26.8,88.91) v1(26.8,88.09) v1(26.8,87.28) v1(27.61,88.91) v1(27.61,88.09) v1(27.61,87.28) v1(36.14,88.78) v1(36.14,87.97) v1(36.14,87.16) v1(36.96,88.78) v1(36.96,87.97) v1(36.96,87.16) v1(37.77,88.78) v1(37.77,87.97) v1(37.77,87.16) v1(38.56,88.78) v1(38.56,87.97) v1(38.56,87.16) v1(39.37,88.78) v1(39.37,87.97) v1(39.37,87.16) v1(40.18,88.78) v1(40.18,87.97) v1(40.18,87.16) v1(42.62,86.11) v1(42.62,85.3) v1(42.62,84.49) v1(43.43,86.11) v1(43.43,85.3) v1(43.43,84.49) v1(44.25,86.11) v1(44.25,85.3) v1(44.25,84.49) v1(45.03,86.11) v1(45.03,85.3) v1(45.03,84.49) v1(45.85,86.11) v1(45.85,85.3) v1(45.85,84.49) v1(46.66,86.11) v1(46.66,85.3) v1(46.66,84.49)
A485: length 13.6
  Top Layer w0.254: U4.6 51.05,28.15 51.43,27.77 53.84,27.77 R3.1 R4.1 57.4,27.63 58.29,28.53 58.29,29.93 59.24,30.88 DSUB1.1
AD_VBUS: length 9.7
  Top Layer w0.254: U2.29 8.89,36.28 8.76,36.41
B485: length 14.8
  Top Layer w0.254: DSUB1.2 60.71,27.9 59.18,27.9 57.41,26.13 R4.2 R3.2 50.79,26.13 49.78,27.14 U4.7
BK: length 31.9
  Bottom Layer w0.254: U2.1 35.69,8.34 38.23,10.88 38.23,29.67 41.53,32.98 H1.4
CLR_L_HD: length 11.4
  Bottom Layer w0.254: U2.36 18.29,18.37 16.56,18.37 16.38,18.19 16.38,16.97 15.49,16.09 8.76,16.09
EBU: length 18.3
  Bottom Layer w0.254: U2.33 17.02,27.52 7.87,27.52 7.49,27.9 7.49,32.85 6.48,33.87 U1.9
EBV: length 23
  Top Layer w0.254: U1.11 5.15,30.26 5.15,27.95 5.83,27.28 9.77,27.28 10.23,26.81 13.03,26.81 13.21,26.63 13.21,25.61 15.24,23.58 U2.34
  Bottom Layer w0.254: 4.7,28.41 4.7,29.8 U1.11
EBW: length 17.3
  Top Layer w0.254: v1(10.67,25.61) 12.32,25.61 12.7,25.23 12.7,24.34 12.95,24.09 13.72,24.09 16.76,21.04 U2.35
  Bottom Layer w0.254: v1(10.67,25.61) 10.16,25.61 9.75,25.2 8,25.2 7.62,25.59 7.62,26.75 6.98,27.39 6.98,28.02 U1.13
ENC_A: length 29.5
  Top Layer w0.254: U1.1 7.37,45.17 28.07,45.17 31.88,41.36 U2.14
ENC_B: length 35.5
  Top Layer w0.254: U2.15 29.84,47.71 13.6,47.71 13.45,47.86 12.97,47.86 12.81,47.71 7.49,47.71 5.21,45.42 5.21,44.9 5.19,44.89 5.19,43.16 5.21,43.15 5.21,42.5 U1.3
HALL_U: length 9.7
  Top Layer w0.254: 8.76,44.03 8.89,43.9 U2.26
HALL_V: length 9.7
  Top Layer w0.254: U2.27 18.29,41.49 8.76,41.49
HALL_W: length 9.7
  Top Layer w0.254: 8.76,38.95 18.29,38.95 18.41,38.82
I2CCK: length 33.2
  Top Layer w0.254: 33.78,46.44 34.16,46.82 41.52,46.82 R2.2 64.25,46.96 66.04,45.17
I2CDA: length 32.8
  Top Layer w0.254: 33.78,48.98 39.24,48.98 40.13,49.87 41.65,49.87 R1.2 41.66,49.87 65.66,49.87 66.04,50.25
IV_U: length 9.7
  Top Layer w0.254: 18.41,33.74 8.89,33.74 8.76,33.87
IV_V: length 9.7
  Top Layer w0.254: U2.31 8.89,31.2 8.76,31.33
IV_W: length 9.7
  Top Layer w0.254: 18.41,28.66 18.29,28.79 8.76,28.79
RS485_E: length 28.3
  Top Layer w0.254: U4.3 U4.2 49.78,25.36 49.11,26.03 R5.1 42.08,26.03 R6.2 37.73,25.86 36.96,26.63 36.96,35.14 35.81,36.28 33.78,36.28
RS485_R: length 19
  Top Layer w0.254: 33.78,28.66 33.86,28.58 35.51,28.58 35.69,28.41 35.69,26.75 39.62,22.82 48.01,22.82 48.51,23.33 U4.1
RS485_T: length 21.9
  Top Layer w0.254: 33.78,26.12 34.16,25.74 35.43,25.74 39.37,21.8 51.31,21.8 52.32,22.82 U4.4
UART1_RX: length 12.3
  Bottom Layer w0.254: 33.78,33.74 36.58,33.74 40.39,37.55 43.81,37.55 H1.2
UART1_TX: length 12.3
  Bottom Layer w0.254: 33.78,31.2 36.58,31.2 40.89,35.52 44.32,35.52
UH: length 28.3
  Bottom Layer w0.254: U2.7 21.46,23.58 20.31,24.73 7.25,24.73 U1.17
UL: length 30.8
  Top Layer w0.254: 8.76,23.71 8.96,23.5 13.54,23.5 13.72,23.33 13.72,18.75 15.11,17.36 19.43,17.36 20.83,15.96 29.27,15.96 29.35,15.88 31.36,15.88 31.43,15.96 U2.4
VH: length 28.4
  Bottom Layer w0.254: U2.6 33.53,21.17 24.51,21.17 23.37,22.31 7.37,22.31 U1.19
VL: length 31.1
  Top Layer w0.254: 8.76,21.17 11.81,21.17 12.32,20.66 12.32,15.58 13.02,14.88 32.19,14.88 33.66,13.42
WH: length 28.3
  Bottom Layer w0.254: U2.5 23.75,18.5 22.59,19.66 7.25,19.66 U1.21
WL: length 29.9
  Top Layer w0.254: U2.2 21.08,10.88 19.81,12.15 13.53,12.15 10.67,15.01 10.67,18.12 10.16,18.63 8.76,18.63

## Copper pours and planes (outline as drawn; the poured copper is in the pictures)
+5V on Top Layer: 56.51,59.27 65.29,59.27 67.82,56.74 67.82,53.68 67.44,53.3 64.39,53.3 62.99,54.69 62.99,55.71 62.74,55.96 56.51,55.96 56.39,56.09 56.39,59.14
+5V on Top Layer: 38.89,56.28 38.89,69.62 42.06,69.62 42.06,56.28
+5V on Top Layer: 39.14,56.28 39.14,60.73 48.16,60.73 48.16,56.28
+5V on Top Layer: 45.97,59.27 56.51,59.27 56.51,55.96 45.97,55.96
+5V on Bottom Layer: 53.01,59.65 58.8,59.65 58.8,55.84 53.01,55.84
GND on Top Layer: 48.29,70.89 48.29,72.16 55.53,72.16 55.53,70.89
GND on Top Layer: -9.53,81.36 89.53,81.36 89.53,-19.85 -9.53,-19.85
GND on Top Layer: 50.57,71.01 50.57,75.97 55.78,75.97 55.78,71.01
GND on Top Layer: 51.59,70.89 51.59,82.7 55.78,82.7 55.78,70.89
GND on Bottom Layer: -5.59,81.24 86.23,81.24 86.23,-16.04 -5.59,-16.04
VBUS on Top Layer: 48.16,74.82 48.16,83.97 50.83,83.97 50.83,74.82
VBUS on Top Layer: 0.38,89.87 71.53,89.87 71.53,83.03 0.38,83.03
VBUS on Bottom Layer: 0.38,89.75 71.43,89.75 71.43,83.03 0.38,83.03
$1N1168 on Top Layer: 38.51,73.43 38.51,76.73 47.27,76.73 47.27,73.43
$1N1168 on Top Layer: 46.84,73.51 46.84,74.44 50.32,74.44 50.32,73.51

Small or netless copper shapes (teardrops, artwork), in the pictures only: 77 on Top Layer, 27 on Bottom Layer

## Text on the board
Top Silkscreen Layer: up | GND | RX | TX | BK | STM32F411 | T1.00 | I2C | 5V | DA | CK
